# EasyEDA Pro project M0电赛.eprj

# Schematic Schematic3
Board Name: Board3; Create Date: 2025-07-26; Page Name: P1; Project Name: M0扩展版; Schematic Name: Schematic3; Update Date: 2025-07-27; Company: 嘉立创EDA; Page Size: A4; Version: V1.0
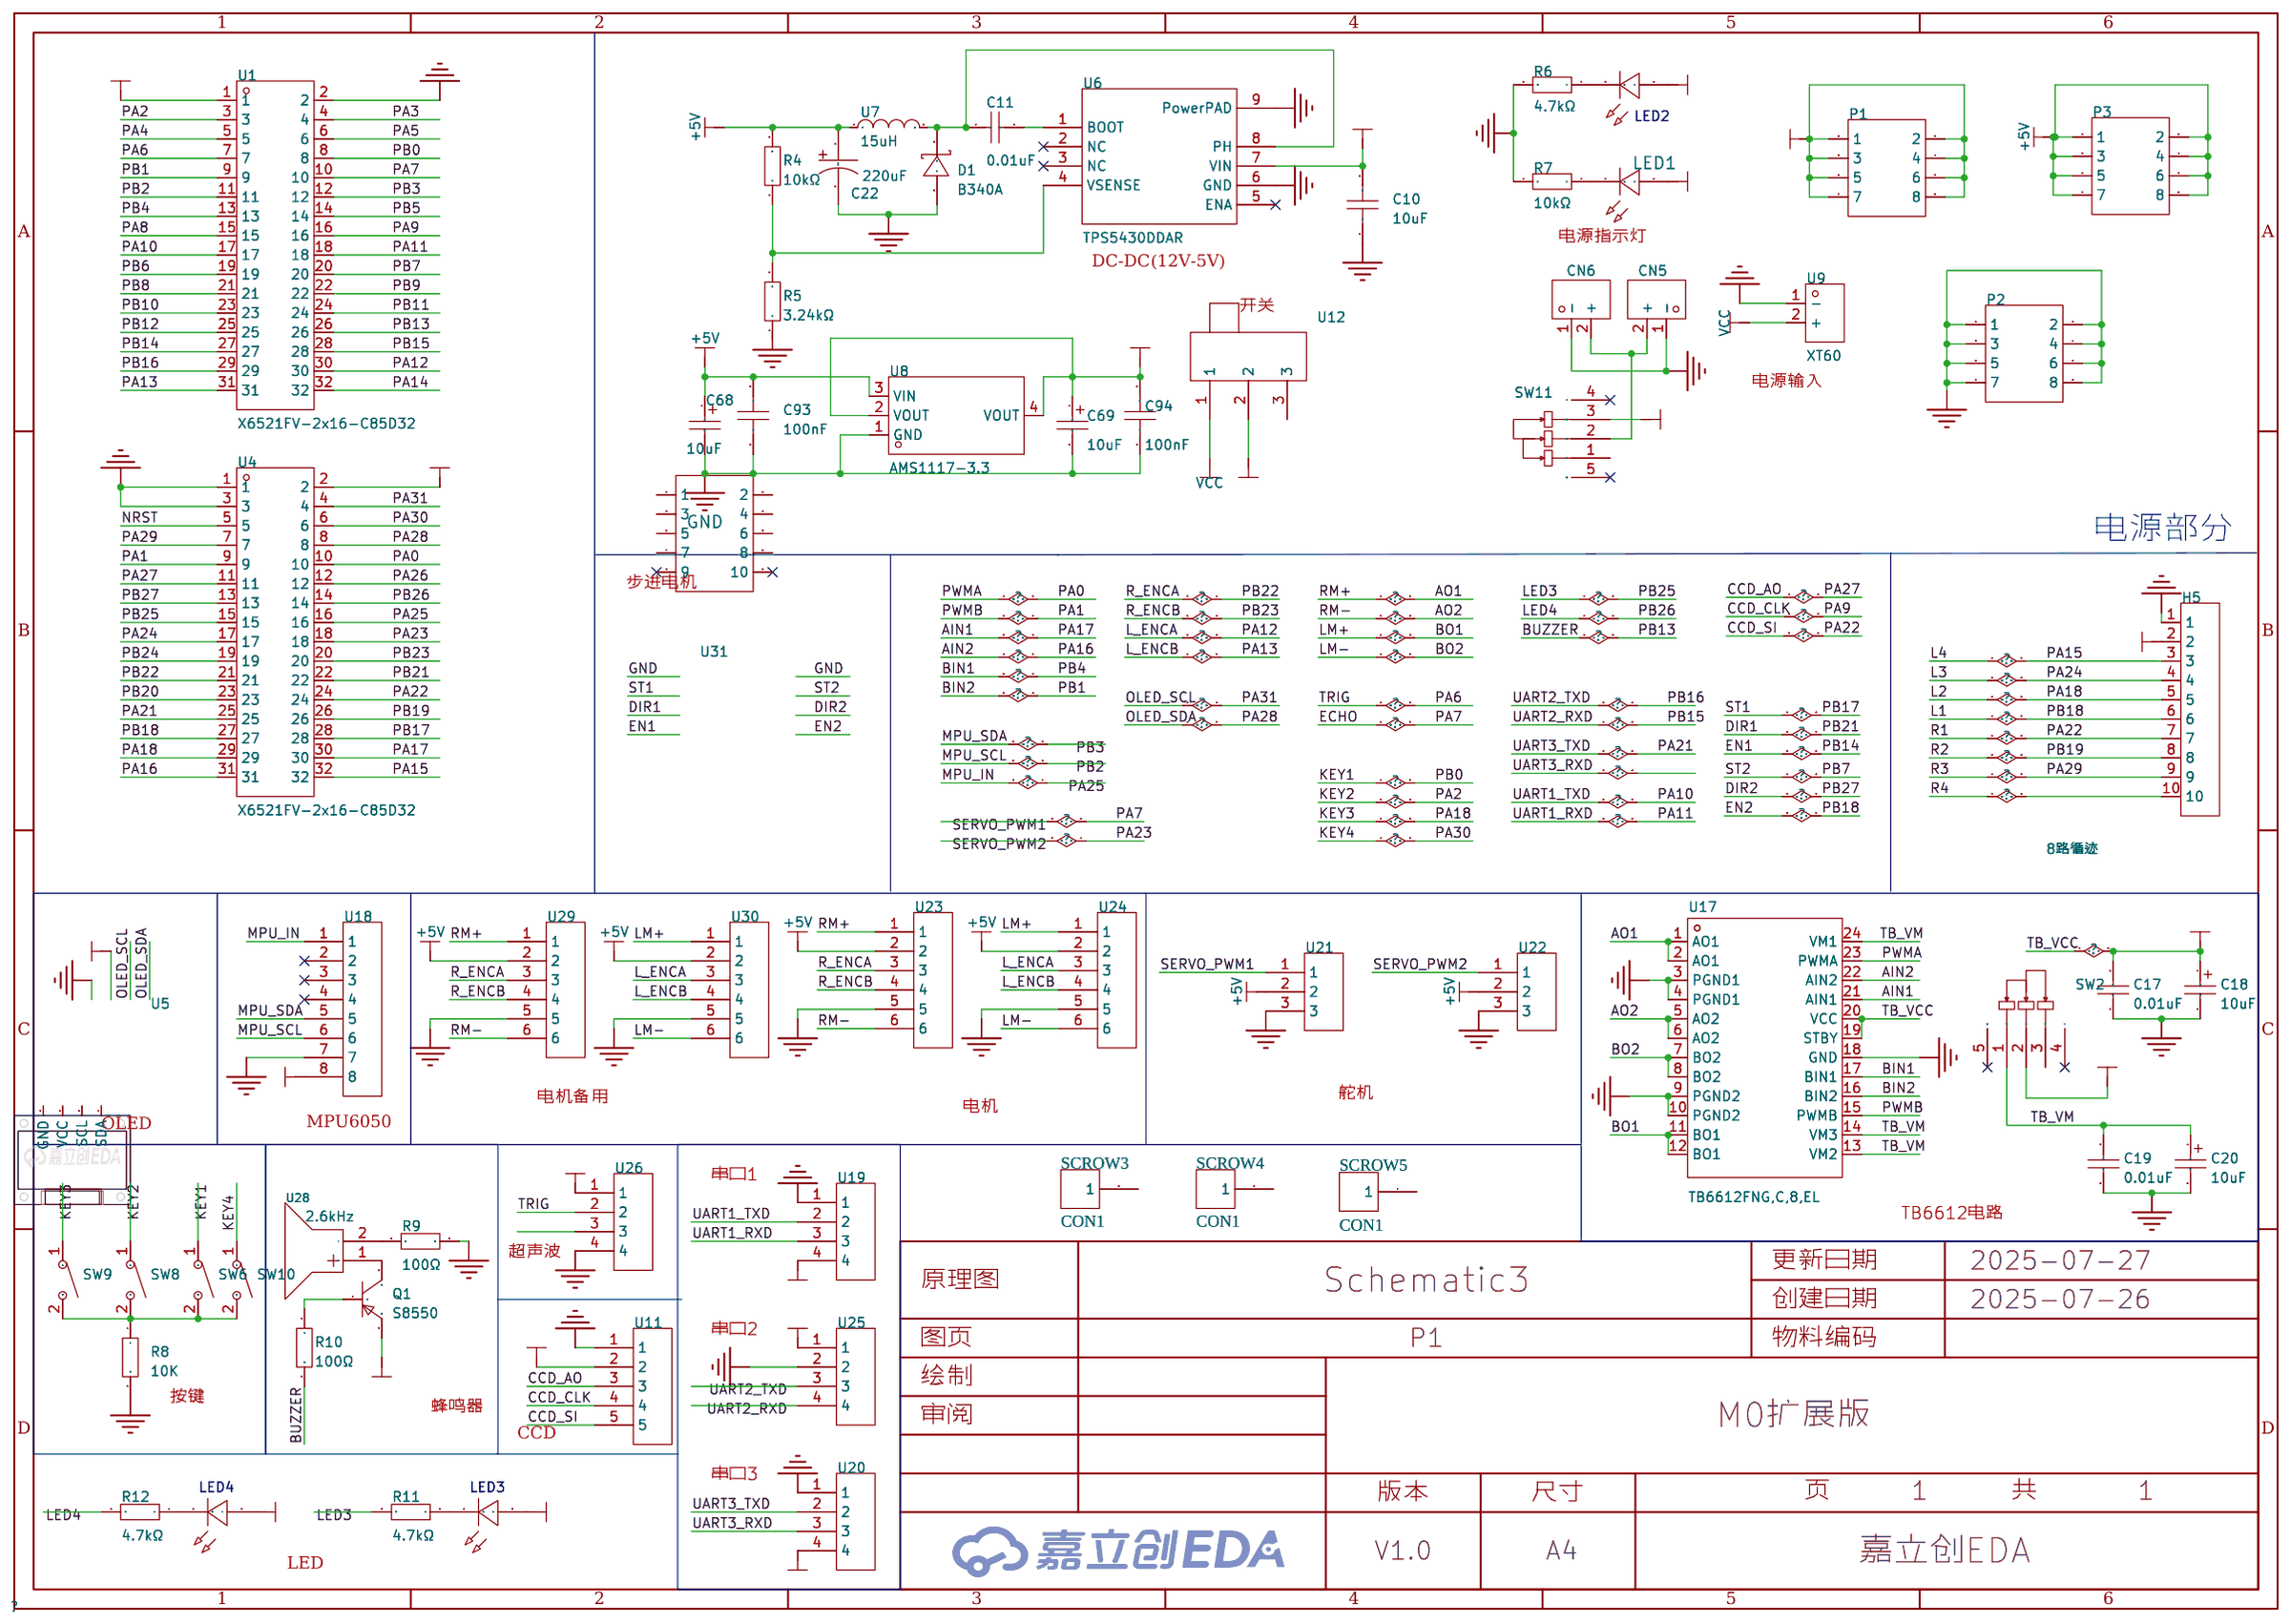
[diagram p0: schematic sheet]

## Parts
C10  10uF  [C0603]
C11  0.01uF  [C0603]
C17  0.01uF  [C0603]
C18  10uF  [case-b_3528]
C19  0.01uF  [C0603]
C20  10uF  [case-b_3528]
C22  220uF  [CAP-SMD_BD6.3-L6.6-W6.6-LS7.2-R-RD]
C68  10uF  [CAP-SMD_L3.2-W1.6-RD]
C69  10uF  [CAP-SMD_L3.2-W1.6-RD]
C93  100nF  [C0603]
C94  100nF  [C0603]
CN5  XT30UPB-M  [CONN-TH_XT30UPB-M]
CN6  XT30UPB-M  [CONN-TH_XT30UPB-M]
D1  B340A  [SMA_L4.3-W2.6-LS5.1-RD]
H5  8路循迹  [HDR-TH_10P-P2.54-V-M]
LED1  -  [led_0603]
LED2  -  [led_0603]
LED3  -  [led0603_blue]
LED4  -  [led0603_blue]
P1  直排针2X4P 2.54mm  [HDR-TH_8P-P2.54-V-M-R2-C4-S2.54]
P2  直排针2X4P 2.54mm  [HDR-TH_8P-P2.54-V-M-R2-C4-S2.54]
P3  直排针2X4P 2.54mm  [HDR-TH_8P-P2.54-V-M-R2-C4-S2.54]
Q1  S8550  [SOT-23-3_L2.9-W1.6-P1.90-LS2.8-BR]
R4  10kΩ  [R0603]
R5  3.24kΩ  [R0603]
R6  4.7kΩ  [R0603]
R7  10kΩ  [R0603]
R8  10K  [R0603]
R9  100Ω  [R0603]
R10  100Ω  [R0603]
R11  4.7kΩ  [R0603]
R12  4.7kΩ  [R0603]
SCROW3  CON1  [LQ_SCROW3&5MM]
SCROW4  CON1  [LQ_SCROW3&5MM]
SCROW5  CON1  [LQ_SCROW3&5MM]
SW2  SK12D07VG3  [SW-TH_SK12D07VG3]
SW6  轻触按键3*6*2.5  [SW-SMD_L6.0-W3.6-LS8.0]
SW8  轻触按键3*6*2.5  [SW-SMD_L6.0-W3.6-LS8.0]
SW9  轻触按键3*6*2.5  [SW-SMD_L6.0-W3.6-LS8.0]
SW10  轻触按键3*6*2.5  [SW-SMD_L6.0-W3.6-LS8.0]
SW11  SK12D07VG3  [SW-TH_SK12D07VG3]
U1  X6521FV-2x16-C85D32  [HDR-TH_32P-P2.54-V-F-R2-C16-S2.54]
U4  X6521FV-2x16-C85D32  [HDR-TH_32P-P2.54-V-F-R2-C16-S2.54]
U5  -  [0.96OLED_4P]
U6  TPS5430DDAR  [ESOP-8_L4.9-W3.9-P1.27-LS6.0-TL-EP]
U7  15uH  [IND-SMD_L6.6-W6.6]
U8  AMS1117-3.3  [SOT-223-3_L6.5-W3.4-P2.30-LS7.0-BR]
U9  XT60  [CONN-TH_XT60]
U11  -  [X2.54_5p]
U12  -  [拨动开关]
U17  TB6612FNG,C,8,EL  [SSOP-24_L8.3-W5.6-P0.65-LS7.6-BL]
U18  -  [MPU6050-8p]
U19  -  [XH2.54_4p]
U20  -  [XH2.54_4p]
U21  -  [X2.54_3p]
U22  -  [X2.54_3p]
U23  -  [XH2.54_6p]
U24  -  [XH2.54_6p]
U25  -  [XH2.54_4p]
U26  -  [XH2.54_4p]
U28  2.6kHz  [BUZ-TH_BD12.0-P7.60-D0.6-FD]
U29  -  [ph2.0]
U30  -  [ph2.0]
U31  -  [2*5p]

## Library data of the parts
C10 = CL10A106KP8NNNC: 容值:10uF;精度:±10%;额定电压:10V;材质(温度系数):X5R;; LCSC Part Name: 10uF ±10% 10V; Supplier Part: C19702; Manufacturer: SAMSUNG(三星); Supplier Footprint: 0603; JLCPCB Part Class: 基础库; Datasheet: https://atta.szlcsc.com/upload/public/pdf/source/20160218/1457707763339.pdf; Supplier: LCSC; Tolerance: ±10%; Voltage Rated: 10V; Temperature Coefficient: X5R
C11 C17 C19 = CL10C100JB8NNNC: 容值:10pF;精度:±5%;额定电压:50V;材质(温度系数):C0G;; LCSC Part Name: 10pF ±5% 50V; Supplier Part: C1634; Manufacturer: SAMSUNG(三星); Supplier Footprint: 0603; JLCPCB Part Class: 基础库; Datasheet: https://atta.szlcsc.com/upload/public/pdf/source/20160218/1457707763339.pdf; Supplier: LCSC; Tolerance: ±5%; Voltage Rated: 50V; Temperature Coefficient: C0G
C18 C20 = TAJC227K010RNJ: 容值:220uF;精度:±10%;额定电压:10V;等效串联电阻:500mΩ@100kHz;; LCSC Part Name: 220uF ±10% 10V; Supplier Part: C8023; Manufacturer: Kyocera AVX; Supplier Footprint: CASE-C-6032; JLCPCB Part Class: 扩展库; Datasheet: https://atta.szlcsc.com/upload/public/pdf/source/20160107/1457707750344.pdf; Supplier: LCSC; Tolerance: ±10%; Rated Voltage: 10V; Equivalent Series Resistance(ESR): 500mΩ@100kHz; Operating Temperature: -55℃~+125℃
C22 = VZT221M1CTR-0606ACS: 容值:220uF;精度:±20%;额定电压:16V;电容体直径:6.3mm;电容体长度:5.8mm;纹波电流:-;等效串联电阻:-;工作寿命:2000hrs@105℃;工作温度:-45℃~+105℃;; LCSC Part Name: 220uF ±20% 16V; Supplier Part: C286136; Manufacturer: lelon(立隆); Supplier Footprint: SMD,D6.3xL5.8mm; JLCPCB Part Class: Extended Part; Datasheet: https://atta.szlcsc.com/upload/public/pdf/source/20180921/C286136_B135157883311A80483BB6A4D6974578.pdf; Supplier: LCSC; Tolerance: ±20%; Rated Voltage: 16V; φD: 6.3mm; L: 5.8mm; Lifetime @ Temp: 2000hrs@105℃; Operating Temperature: -45℃~+105℃
C68 C69 = TC212A106K016Y: 容值:10uF;精度:±10%;额定电压:16V;等效串联电阻:3Ω@100kHz;; LCSC Part Name: 10uF ±10% 16V; Supplier Part: C108529; Manufacturer: Sunlord(顺络); Supplier Footprint: CASE-A-3216; JLCPCB Part Class: Extended Part; Datasheet: https://atta.szlcsc.com/upload/public/pdf/source/20210916/D7C773B25EB30D21AD10ECA5EBDA1DBD.pdf; Supplier: LCSC; Tolerance: ±10%; Rated Voltage: 16V; Equivalent Series Resistance(ESR): 3Ω@100kHz; Operating Temperature: -55℃~+125℃
C93 C94 = CC0603KRX7R9BB104: 容值:100nF;精度:±10%;额定电压:50V;材质(温度系数):X7R;; LCSC Part Name: 100nF ±10% 50V; Supplier Part: C14663; Manufacturer: YAGEO(国巨); Supplier Footprint: 0603; JLCPCB Part Class: 基础库; Datasheet: https://atta.szlcsc.com/upload/public/pdf/source/20180910/C282072_33301C7F631E79921B82A8DAC6BCC5B3.pdf; Supplier: LCSC; Tolerance: ±10%; Voltage Rated: 50V; Temperature Coefficient: X7R
CN5 CN6 = XT30UPB-M: Supplier Part: C428721; Manufacturer: AMASS(艾迈斯); JLCPCB Part Class: Extended Part; Datasheet: https://atta.szlcsc.com/upload/public/pdf/source/20190916/C428721_B0ECB8C5937139CEFE8736D2D3175B0E.pdf; Supplier: LCSC
D1 = B340A: 正向压降(Vf):550mV@3A;直流反向耐压(Vr):40V;平均整流电流(Io):3A;; LCSC Part Name: 电压:40V 电流:3A; Supplier Part: C64982; Manufacturer: MDD; Supplier Footprint: SMA(DO-214AC); JLCPCB Part Class: 扩展库; Datasheet: https://atta.szlcsc.com/upload/public/pdf/source/20230710/CC7CF81239BC87A7012E02A96905E83C.pdf; Supplier: LCSC; Forward Voltage (Vf@If): 550mV@3A; Reverse Voltage (Vr): 40V; Average Rectified Current (Io): 3A
H5 = PZ254V-11-10P: 插针结构:1x10P;间距:2.54mm;行距:-;圆针/方针:方针;安装方式:直插;排数:单排;总PIN位数:10P;额定电流:-;额定电压:-;配合针长度:6mm;塑高:2.5mm;端接针长度:3mm;触头材质:黄铜;触头镀层:-;工作温度:-40℃~+105℃;颜色:黑色;; LCSC Part Name: 1x10P 间距:2.54mm 方针 直插; Supplier Part: C492409; Manufacturer: XFCN(兴飞); Supplier Footprint: 插件,P=2.54mm; JLCPCB Part Class: 扩展库; Datasheet: https://atta.szlcsc.com/upload/public/pdf/source/20200309/C492409_129C9431BDD62EBBBD0A643B6AAB9FBD.pdf; Supplier: LCSC; Pin Structure: 1x10P; Pitch: 2.54mm; Circluar Pins/Square Pins: 方针; Mounting Type: 直插; Number of Rows: 单排; Number of Pins: 10P; Length of Mating Pin: 6mm; Insulation Height: 2.5mm; Length of End Connection Pin: 3mm; Contact Material: 黄铜; Operating Temperature: -40℃~+105℃; Color: 黑色
LED1 = LED_0402-R: Supplier Footprint: 0402
LED2-LED4 = LED_0402-G: Supplier Footprint: 0402
P1-P3 = 直排针2X4P 2.54mm: 排数:-;圆针/方针:-;额定电流:-;额定电压:-;配合针长度:-;塑高:-;触头材质:-;; LCSC Part Name: 排针 2*4P 2.54mm; Supplier Part: C58363; Manufacturer: BOOMELE(博穆精密); Supplier Footprint: 插件,P=2.54mm; JLCPCB Part Class: Extended Part; Datasheet: https://atta.szlcsc.com/upload/public/pdf/source/20151026/1457707506726.pdf; Supplier: LCSC
Q1 = S8550_C105432: 晶体管类型:PNP;集电极电流(Ic):500mA;集射极击穿电压(Vceo):25V;功率(Pd):300mW;直流电流增益(hFE@Ic,Vce):120@50mA,1V;; LCSC Part Name: S8550(RANGE:120-200) L档120-200; Supplier Part: C105432; Manufacturer: CJ(江苏长电/长晶); Supplier Footprint: SOT-23; JLCPCB Part Class: 基础库; Datasheet: https://atta.szlcsc.com/upload/public/pdf/source/20171228/C164891_15144412930301213894.pdf; Supplier: LCSC; Transistor Type: PNP; Collector Current (Ic): 500mA; Collector-Emitter Breakdown Voltage (Vceo): 25V; Power Dissipation (Pd): 300mW; DC Current Gain (hFE@Ic,Vce): 120@50mA,1V; Transition Frequency (fT): 150MHz; Collector Cut-Off Current (Icbo): 100nA; Collector-Emitter Saturation Voltage (VCE(sat)@Ic,Ib): 600mV@500mA,50mA
R4 R5 = 0603WAF1002T5E: 电阻类型:厚膜电阻;阻值:10kΩ;精度:±1%;功率:100mW;最大工作电压:75V;温度系数:±100ppm/℃;; LCSC Part Name: 厚膜电阻 10kΩ ±1% 100mW; Supplier Part: C25804; Manufacturer: UNI-ROYAL(厚声); Supplier Footprint: 0603; JLCPCB Part Class: 基础库; Datasheet: https://atta.szlcsc.com/upload/public/pdf/source/20200306/C422600_1E6D84923E4A46A82E41ADD87F860B5C.pdf; Supplier: LCSC; Type: 厚膜电阻; Tolerance: ±1%; Power(Watts): 100mW; Overload Voltage (Max): 75V; Temperature Coefficient: ±100ppm/℃; Operating Temperature Range: -55℃~+155℃
R6 R7 R11 R12 = 0603WAF4701T5E: 电阻类型:厚膜电阻;阻值:4.7kΩ;精度:±1%;功率:100mW;最大工作电压:75V;温度系数:±100ppm/℃;; LCSC Part Name: 4.7kΩ ±1% 100mW 厚膜电阻; Supplier Part: C23162; Manufacturer: UNI-ROYAL(厚声); Supplier Footprint: 0603; JLCPCB Part Class: 基础库; Datasheet: https://atta.szlcsc.com/upload/public/pdf/source/20200306/C422600_1E6D84923E4A46A82E41ADD87F860B5C.pdf; Supplier: LCSC; Type: 厚膜电阻; Tolerance: ±1%; Power(Watts): 100mW; Overload Voltage (Max): 75V; Temperature Coefficient: ±100ppm/℃; Operating Temperature Range: -55℃~+155℃
R8-R10 = Res_0603: Supplier Footprint: 0603
SCROW3-SCROW5 = CON1: Connector; Library Name: LQ8701
SW2 SW11 = SK12D07VG3: LCSC Part Name: 两档位卧式拨动开关,柄长3MM; Supplier Part: C431547; Manufacturer: SHOU HAN(首韩); Supplier Footprint: 插件; JLCPCB Part Class: Extended Part; Datasheet: https://atta.szlcsc.com/upload/public/pdf/source/20190925/C431547_01B93C6F3FA5C09E15F8CCBF4E6DB91A.pdf; Supplier: LCSC
SW6 SW8-SW10 = 轻触按键3*6*2.5: Supplier Part: C9900013040; Supplier Footprint: KEY; JLCPCB Part Class: 扩展库; Supplier: LCSC
U1 U4 = X6521FV-2x16-C85D32: 插孔结构:2x16P;间距:2.54mm;行距:2.54mm;圆孔/方孔:方孔;安装类型:直插;排数:双排;总孔位数:32P;额定电流:3A;额定电压:250V;插孔方向:顶部;塑高:8.5mm;触头材质:黄铜;触头镀层:金;工作温度范围:-40℃~+105℃;焊接温度(最大值):260℃;; LCSC Part Name: 间距:2.54mm 2x16P 直插; Supplier Part: C2883989; Manufacturer: XKB Connection(中国星坤); Supplier Footprint: 插件,P=2.54mm; JLCPCB Part Class: 扩展库; Datasheet: https://atta.szlcsc.com/upload/public/pdf/source/20211009/C636DBF0733662F7F428F4420CCBBD46.pdf; Supplier: LCSC; Holes Structure: 2x16P; Pitch: 2.54mm; Row Spacing: 2.54mm; Circular Hole / Square Hole: 方孔; Mounting Type: 直插; Number of Rows: 双排; Number of Holes: 32P; Current Rating (Max): 3A; Voltage Rating (Max): 250V; Holes Direction: 顶部; Insulation Height: 8.5mm; Contact Material: 黄铜; Contact Plating: 金; Operating Temperature Range: -40℃~+105℃; Soldering Temperature(Max): 260℃
U5 = 0.96OLED模块_4P: Supplier Footprint: 插件
U6 = TPS5430DDAR: 功能类型:降压型;输出类型:可调;输入电压:5.5V~36V;输出电压:1.221V~32.04V;输出电流(最大值):3A;; LCSC Part Name: 降压 3A 36V; Supplier Part: C9864; Manufacturer: TI(德州仪器); Supplier Footprint: SOIC-8-EP; JLCPCB Part Class: 基础库; Datasheet: https://www.ti.com/cn/lit/gpn/tps5430; Supplier: LCSC; Function: 降压型; Output Type: 可调; Input Voltage: 5.5V~36V; Output Voltage: 1.221V~32.04V; Output Current (Max): 3A; Switching Frequency: 500kHz; Operating Temperature: -40℃~+125℃@(TJ); Synchronous Rectification: 否; Number of Outputs: 1; Topology: 降压式; Switch tube (built-in/external): 内置
U7 = 15uH: Supplier Part: C9900014578; Supplier Footprint: L_电感_7*7; JLCPCB Part Class: 扩展库; Supplier: LCSC
U8 = AMS1117-3.3_C6186: 输出类型:固定;最大输入电压:-;输出电压:3.3V;最大输出电流:1A;电源纹波抑制比(PSRR):72dB@(120Hz);输出极性:正极;; LCSC Part Name: 输出3.3V 1A; Supplier Part: C6186; Manufacturer: AMS; Supplier Footprint: SOT-223; JLCPCB Part Class: 基础库; Datasheet: https://atta.szlcsc.com/upload/public/pdf/source/20180727/C6186_7A095716F0823C02F1997A905E26C086.pdf; Supplier: LCSC; Output Type: 固定; Output Voltage: 3.3V; MAX Output Current: 1A; Power Supply Rejection Ratio (PSRR): 72dB@(120Hz); Dropout Voltage: 1.3V@(800mA); Output Polarity: 正极; Number of Outputs: 1
U9 = XT60: 类别:-;类型1:-;; LCSC Part Name: AMASS(艾迈斯) XT60模型插头 3.5mm镀金香蕉头公头（电调端）XT60-M; Supplier Part: C98733; Manufacturer: AMASS(艾迈斯); JLCPCB Part Class: 扩展库; Datasheet: https://atta.szlcsc.com/upload/public/pdf/source/20170606/1496716524919.pdf; Supplier: LCSC; Brand: 艾迈斯; Type: 香蕉头; Colour: 黄色; InterfaceType: 公头; specifications: 3.5mm
U11 = X2.54_5p
U12 = 拨动开关
U17 = TB6612FNG,C,8,EL: 驱动电机类型:有刷直流电机;电源电压:2.7V~5.5V;输出电流:1A;接口:并行;; LCSC Part Name: 1A 有刷直流电机驱动芯片 5.5V; Supplier Part: C141517; Manufacturer: TOSHIBA(东芝); Supplier Footprint: SSOP-24; JLCPCB Part Class: 扩展库; Datasheet: https://atta.szlcsc.com/upload/public/pdf/source/20171128/C141517_15118625624231147036.pdf; Supplier: LCSC; Drive motor type: 有刷直流电机; Supply Voltage: 2.7V~5.5V; Output Current: 1A; Interface: 并行; Operating Temperature: -20℃~+85℃@(Ta)
U18 = MPU6050_8p
U19 U20 U25 U26 = XH2.54_4P
U21 U22 = X2.54 _3p
U23 U24 U29 U30 = XH2.54_6p
U28 = HYE1206-05ST: 频率:2.6kHz;声压(SPL):80dB@5V,10cm;; LCSC Part Name: 有源蜂鸣器HYE1206-05ST; Supplier Part: C17701079; Manufacturer: HYDZ(华宇); Supplier Footprint: 插件,D=7.6mm; Datasheet: https://atta.szlcsc.com/upload/public/pdf/source/20230912/EF3443D3A1B92F495A3EE65EE7F2091F.pdf; Supplier: LCSC; Sound Pressure Level (SPL): 80dB@5V,10cm
U31 = 2*5p

## Nets
3V3: C17.2 C18.1 C69.1 C94.2 LED2.2(A) LED3.2(A) LED4.2(A) P1.1 P1.2 P1.3 P1.4 P1.5 P1.6 P1.7 P1.8 Q1.2 U1.1 U4.2 U8.2(VOUT) U8.4(VOUT) U11.2 U17.19(STBY) U17.20(VCC) U18.8 U19.4 U20.4 U25.1 U26.1
5V: H5.2
+5V: C22.1 C68.1 C93.2 LED1.2(A) P3.1 P3.2 P3.3 P3.4 P3.5 P3.6 P3.7 P3.8 R4.2 U7.1 U8.3(VIN) U21.2 U22.2 U23.2 U24.2 U29.2 U30.2
+12V: C10.2 SW2.2 SW11.3 U6.7(VIN) U12.2
GND: C10.1 C17.1 C18.2 C19.1 C20.2 C22.2 C68.2 C69.2 C93.1 C94.1 CN5.1(-) CN6.1(-) D1.2(A) H5.1 P2.1 P2.2 P2.3 P2.4 P2.5 P2.6 P2.7 P2.8 R5.1 R6.2 R7.2 R8.2 R9.1 U1.2 U4.1 U4.3 U6.6(GND) U6.9(PowerPAD) U8.1(GND) U9.1(-) U11.1 U17.3(PGND1) U17.4(PGND1) U17.9(PGND2) U17.10(PGND2) U17.18(GND) U18.7 U19.1 U20.1 U21.3 U22.3 U23.5 U24.5 U25.2 U26.4 U29.5 U30.5
VCC: U9.2(+) U12.1
AIN1: U4.30 U17.21(AIN1)
AIN2: U4.31 U17.22(AIN2)
AO1: U17.1(AO1) U17.2(AO1) U23.1 U29.1
AO2: U17.5(AO2) U17.6(AO2) U23.6 U29.6
BIN1: U1.13 U17.17(BIN1)
BIN2: U1.9 U17.16(BIN2)
BO1: U17.11(BO1) U17.12(BO1) U24.1 U30.1
BO2: U17.7(BO2) U17.8(BO2) U24.6 U30.6
BUZZER: R10.2 U1.26
CCD_AO: U4.11 U11.3
CCD_CLK: U1.16 U11.4
CCD_SI: H5.7 U4.24 U11.5
DIR1: U4.22
DIR2: U4.13
ECHO: U1.10 U21.1
EN1: U1.27
EN2: H5.6 U4.27
KEY1: SW6.1 U1.8
KEY2: SW8.1 U1.3
KEY3: H5.5 SW9.1 U4.29
KEY4: SW10.1 U4.6
L3: H5.4 U4.17
L4: H5.3 U4.32
L_ENCA: U1.30 U24.3 U30.3
L_ENCB: U1.31 U24.4 U30.4
LED3: R11.2 U4.15
LED4: R12.2 U4.14
MPU_IN: U4.16 U18.1
MPU_SCL: U1.11 U18.6
MPU_SDA: U1.12 U18.5
NRST: U4.5
OLED_SCL: U4.4
OLED_SDA: U4.8
PA0: U4.10 U17.23(PWMA)
PA1: U4.9 U17.15(PWMB)
PA3: U1.4
PA4: U1.5
PA5: U1.6
PA6: U1.7 U26.2
PA8: U1.15
PA10: U1.17 U19.2
PA11: U1.18 U19.3
PA14: U1.32
PA21: U4.25 U20.2
PA23: U4.18 U22.1
PA26: U4.12
PA29: H5.9 U4.7
PB5: U1.14
PB6: U1.19
PB7: U1.20
PB8: U1.21
PB9: U1.22
PB10: U1.23
PB11: U1.24
PB12: U1.25
PB15: U1.28 U25.4
PB16: U1.29 U25.3
PB17: U4.28
PB19: H5.8 U4.26
PB20: U4.23
PB22: U4.21 U23.3 U29.3
PB23: U4.20 U23.4 U29.4
PB24: U4.19
R4: H5.10
TB_VM: C19.2 C20.1 SW2.1 U17.13(VM2) U17.14(VM3) U17.24(VM1)
UART3_RXD: U20.3
$1N1731: LED2.1(C) R6.1
$1N1733: LED1.1(C) R7.1
$1N2121: C11.2 U6.1(BOOT)
$1N2122: C11.1 D1.1(K) U6.8(PH) U7.2
$1N2124: R4.1 R5.2 U6.4(VSENSE)
$1N2587: R8.1 SW6.2 SW8.2 SW9.2 SW10.2
$1N2737: LED3.1(C) R11.1
$1N2739: LED4.1(C) R12.1
$1N3007: Q1.3 U28.1(+)
$1N3009: Q1.1 R10.1
$1N3011: R9.2 U28.2(-)
$1N21326: CN5.2(+) CN6.2(+) SW11.2

Not connected (* = marked no-connect by the designer): SCROW3 1; SCROW4 1; SCROW5 1; SW2 3 4* 5*; SW11 1 4* 5*; U5 1(GND) 2(VCC) 3(SCL) 4(SDA); U6 2(NC)* 3(NC)* 5(ENA)*; U12 3; U18 2* 3* 4*; U26 3; U31 1 2 3 4 5 6 7 8 9* 10*

## Notes on the sheet
- 电源指示灯
- DC-DC(12V-5V)
- 开关
- 电源输入
- 电源部分
- 步进电机
- 电机备用
- 电机
- 舵机
- OLED
- MPU6050
- 串口1
- TB6612电路
- 超声波
- 串口2
- 按键
- 蜂鸣器
- CCD
- 串口3
- LED

# Board PCB3
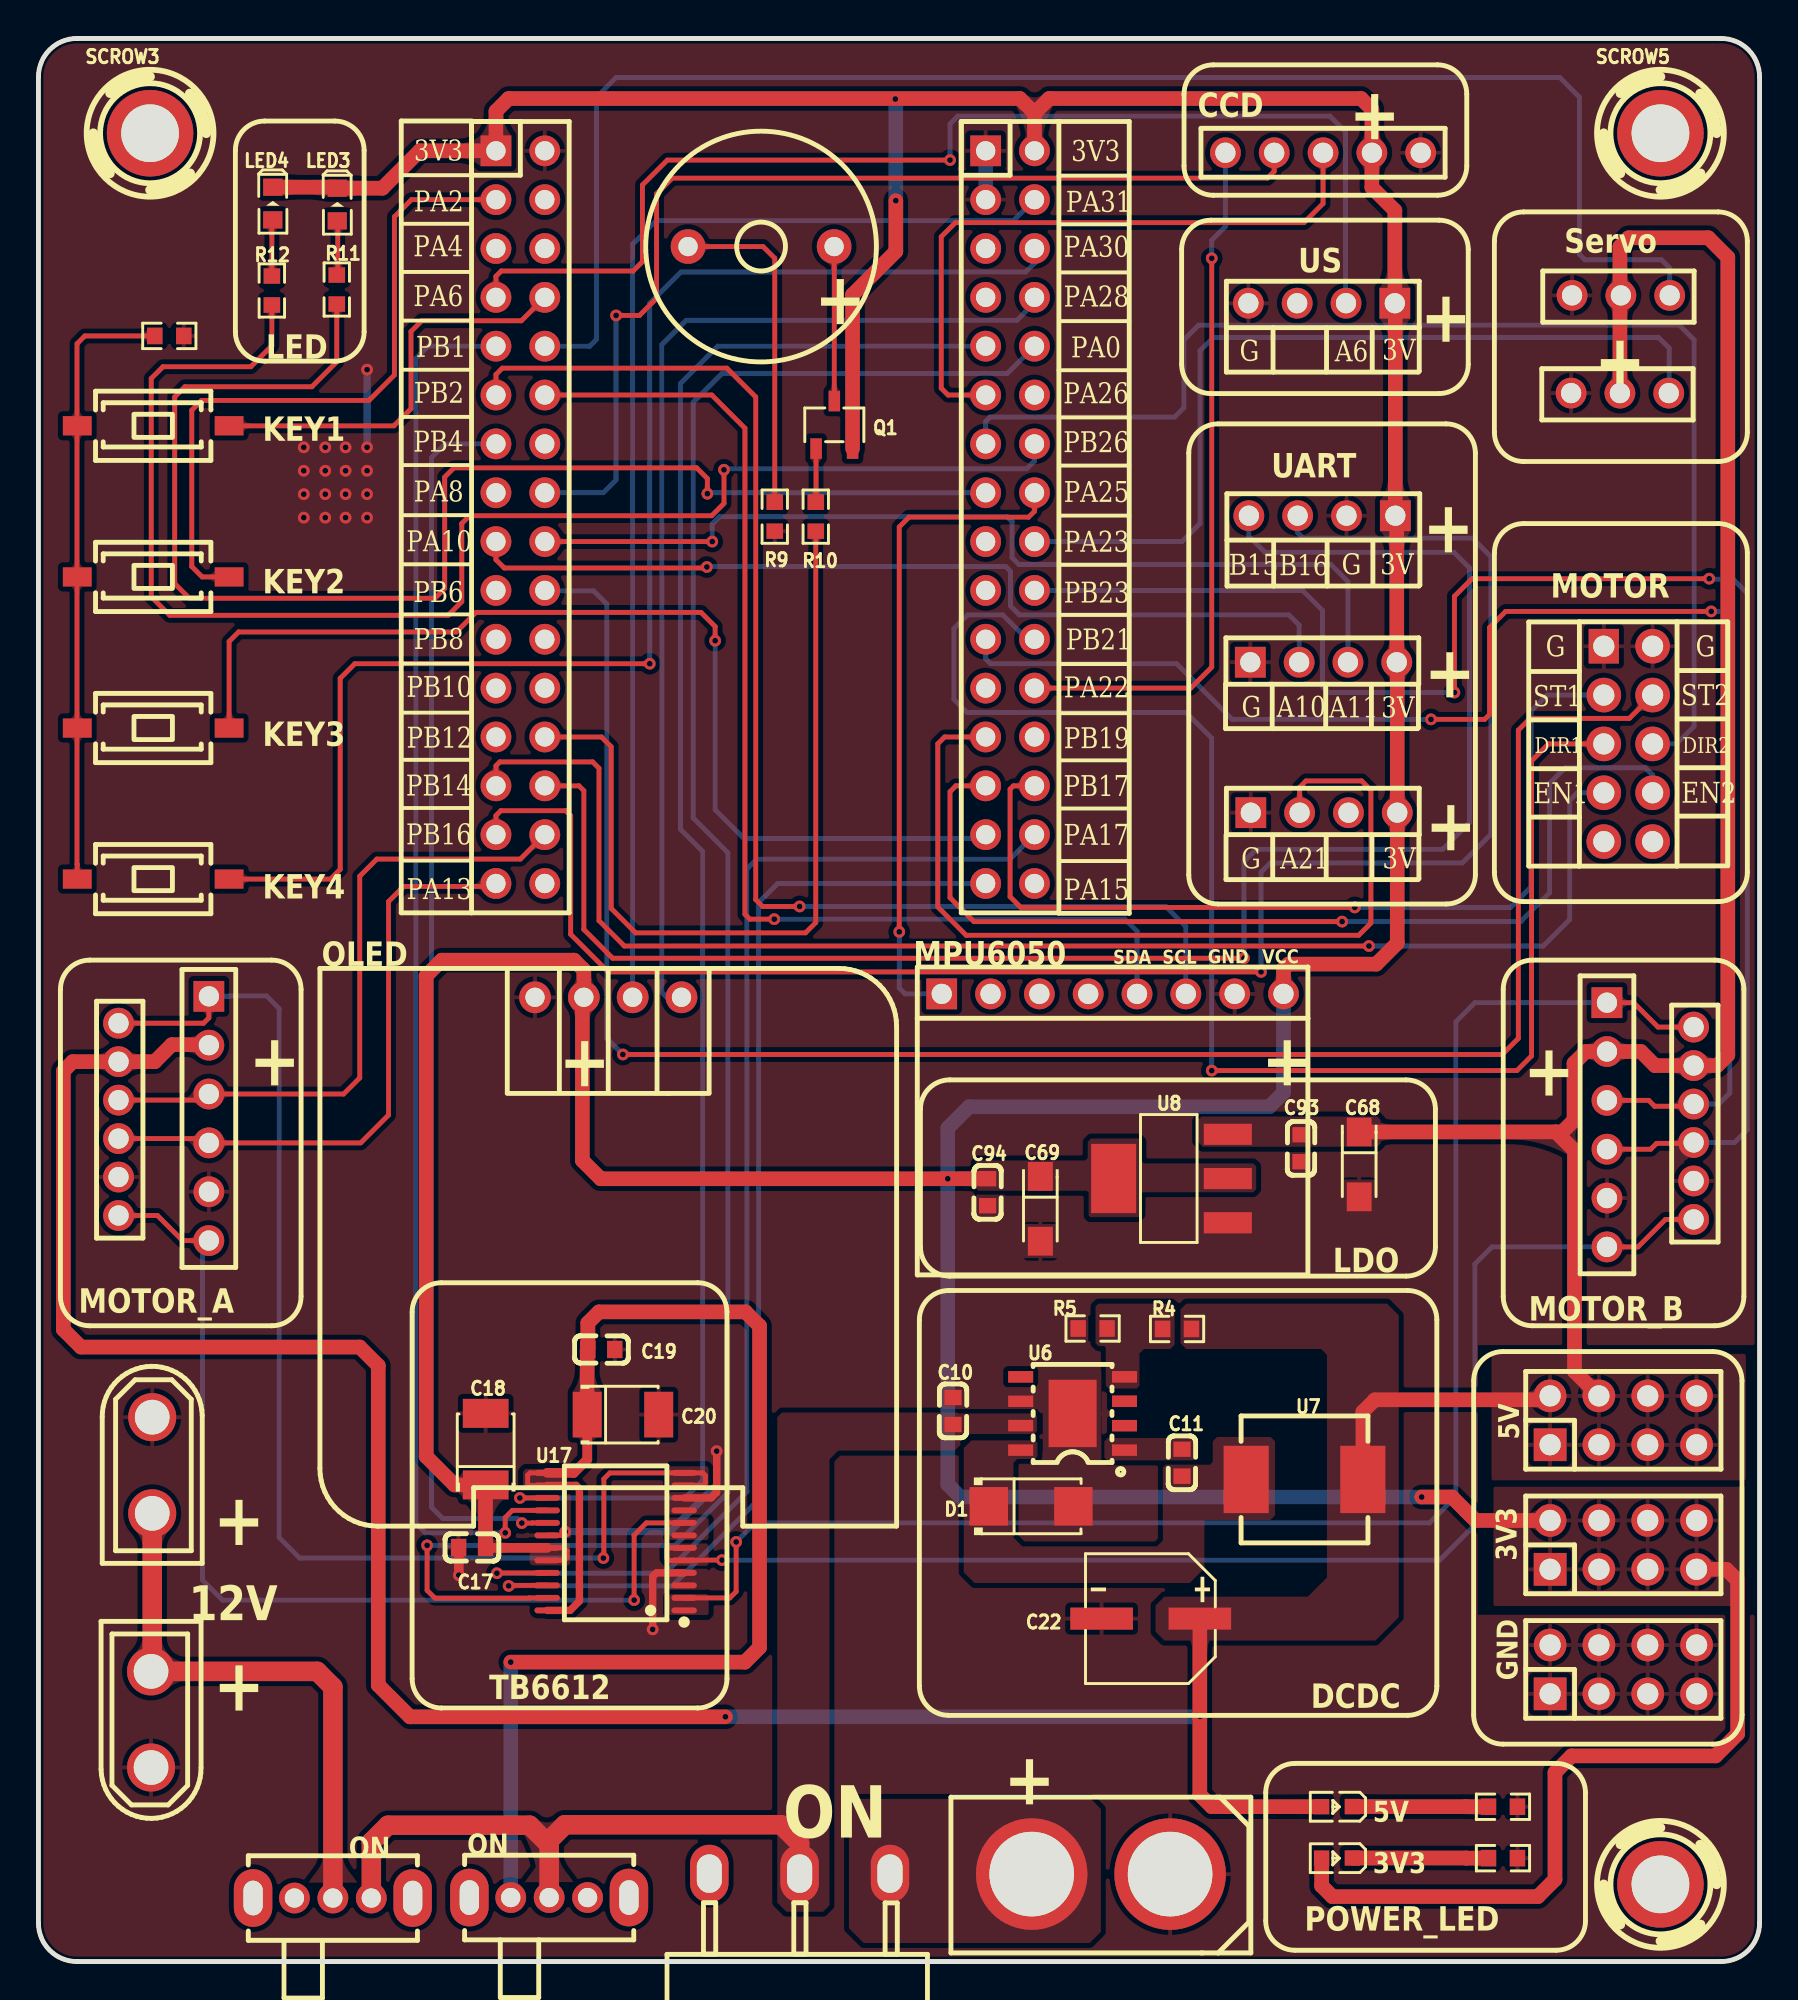
[diagram p1: board, top side]
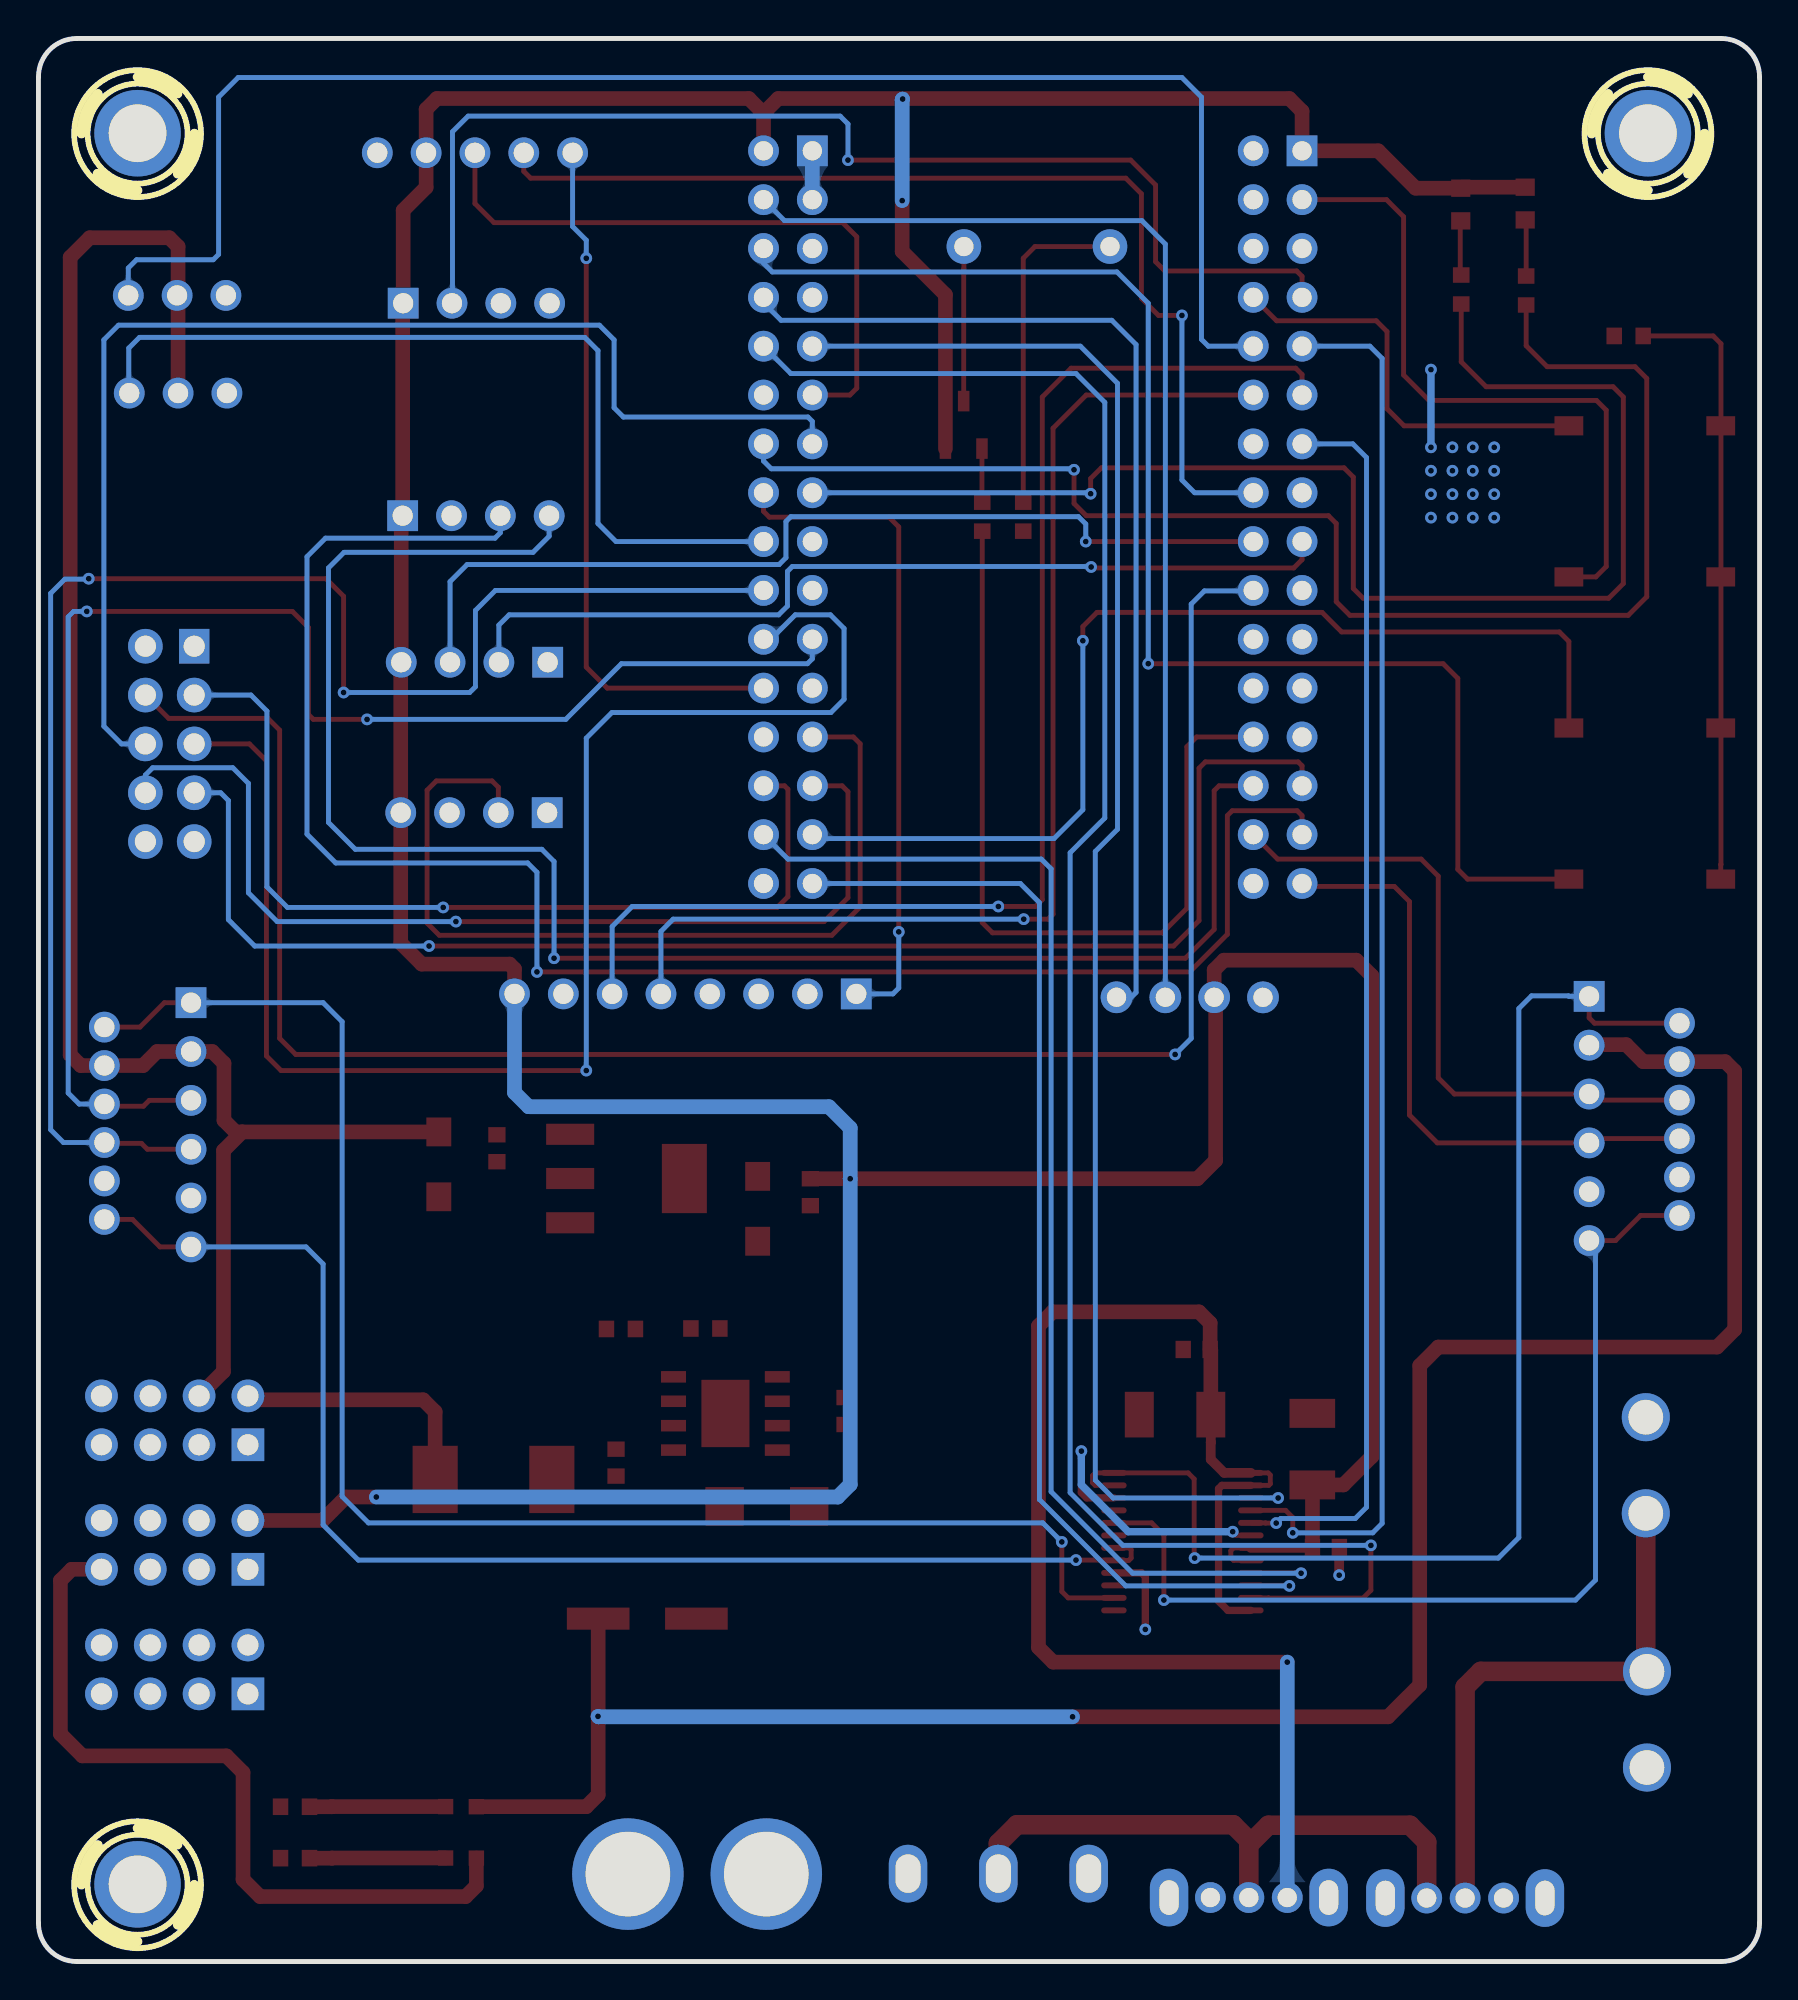
[diagram p2: board, bottom side, seen from below]

Outline 89.53 x 100 mm; copper layers: Top Layer, Bottom Layer. Coordinates in mm from the lower left corner of the outline.
Outline path: 0,98 0,2 arc(0.59,0.59) 2,0 87.53,0 arc(88.95,0.59) 89.53,2 89.53,98 arc(88.95,99.41) 87.53,100 2,100 arc(0.59,99.41) 0,98
Stack: Top Layer 0.035mm / Dielectric1 1.51mm FR4 er 4.5 / Bottom Layer 0.035mm

## Design rules (mm)
template: JLCPCB Capability(Two Layers Board)
spacing copperThickness1oz (default): track to track 0.102, other pairs 0.152 to 0.3
spacing copperThickness2oz: track to track 0.203, other pairs 0.152 to 0.3
track width copperThickness1oz (default): min 0.127, default 0.254, max 2.54
track width copperThickness2oz: min 0.203, default 0.254, max 2.54
differential pair differentialPair (default): width min 0.127, default 0.254, max 2.54; gap min 0.152, default 0.152
via viaSize (default): diameter min 0.5, default 0.61, max 10; hole min 0.3, default 0.305, max 6.3

## Placement (name value [footprint] x y rotation side)
C10  10uF  [C0603]  47.57 28.63 270 top
C11  0.01uF  [C0603]  59.49 25.94 90 top
C17  0.01uF  [C0603]  22.56 21.53 0 top
C18  10uF  [case-b_3528]  23.27 26.65 90 top
C19  0.01uF  [C0603]  29.28 31.83 180 top
C20  10uF  [case-b_3528]  30.41 28.44 0 top
C22  220uF  [CAP-SMD_BD6.3-L6.6-W6.6-LS7.2-R-RD]  57.86 17.83 0 top
C68  10uF  [CAP-SMD_L3.2-W1.6-RD]  68.71 41.45 270 top
C69  10uF  [CAP-SMD_L3.2-W1.6-RD]  52.12 39.14 270 top
C93  100nF  [C0603]  65.68 42.29 90 top
C94  100nF  [C0603]  49.38 40 90 top
CN5  XT30UPB-M  [CONN-TH_XT30UPB-M]  5.86 12.59 90 top
CN6  XT30UPB-M  [CONN-TH_XT30UPB-M]  5.92 25.81 270 top
D1  B340A  [SMA_L4.3-W2.6-LS5.1-RD]  51.64 23.67 0 top
LED1  -  [led_0603]  67.5 8.05 180 top
LED2  -  [led_0603]  67.5 5.37 180 top
LED3  -  [led0603_blue]  15.54 91.36 90 top
LED4  -  [led0603_blue]  12.19 91.42 90 top
P1  直排针2X4P 2.54mm  [HDR-TH_8P-P2.54-V-M-R2-C4-S2.54]  82.45 21.67 0 top
P2  直排针2X4P 2.54mm  [HDR-TH_8P-P2.54-V-M-R2-C4-S2.54]  82.45 15.19 0 top
P3  直排针2X4P 2.54mm  [HDR-TH_8P-P2.54-V-M-R2-C4-S2.54]  82.45 28.14 0 top
Q1  S8550  [SOT-23-3_L2.9-W1.6-P1.90-LS2.8-BR]  41.4 79.91 270 top
R4  10kΩ  [R0603]  59.23 32.89 0 top
R5  3.24kΩ  [R0603]  54.84 32.92 0 top
R6  4.7kΩ  [R0603]  76.19 5.38 0 top
R7  10kΩ  [R0603]  76.19 8.05 0 top
R8  10K  [R0603]  6.81 84.53 0 top
R9  100Ω  [R0603]  38.3 75.13 90 top
R10  100Ω  [R0603]  40.44 75.13 270 top
R11  4.7kΩ  [R0603]  15.52 86.94 270 top
R12  4.7kΩ  [R0603]  12.14 86.89 270 top
SCROW3  CON1  [LQ_SCROW3&5MM]  5.81 95.07 0 top
SCROW4  CON1  [LQ_SCROW3&5MM]  84.38 4.01 0 top
SCROW5  CON1  [LQ_SCROW3&5MM]  84.38 95.07 0 top
SW2  SK12D07VG3  [SW-TH_SK12D07VG3]  26.57 3.33 0 top
SW6  轻触按键3*6*2.5  [SW-SMD_L6.0-W3.6-LS8.0]  5.97 79.86 180 top
SW8  轻触按键3*6*2.5  [SW-SMD_L6.0-W3.6-LS8.0]  5.97 72 180 top
SW9  轻触按键3*6*2.5  [SW-SMD_L6.0-W3.6-LS8.0]  5.97 64.14 180 top
SW10  轻触按键3*6*2.5  [SW-SMD_L6.0-W3.6-LS8.0]  5.97 56.29 180 top
SW11  SK12D07VG3  [SW-TH_SK12D07VG3]  15.32 3.3 0 top
U1  X6521FV-2x16-C85D32  [HDR-TH_32P-P2.54-V-F-R2-C16-S2.54]  25.07 75.11 270 top
U4  X6521FV-2x16-C85D32  [HDR-TH_32P-P2.54-V-F-R2-C16-S2.54]  50.55 75.11 270 top
U5  -  [0.96OLED_4P]  29.64 50.14 0 top
U6  TPS5430DDAR  [ESOP-8_L4.9-W3.9-P1.27-LS6.0-TL-EP]  53.8 28.5 180 top
U7  15uH  [IND-SMD_L6.6-W6.6]  65.86 25.07 180 top
U8  AMS1117-3.3  [SOT-223-3_L6.5-W3.4-P2.30-LS7.0-BR]  58.9 40.72 0 top
U9  XT60  [CONN-TH_XT60]  55.27 4.55 180 top
U11  -  [X2.54_5p]  68.86 93.93 180 top
U12  -  [拨动开关]  44.3 4.57 180 top
U17  TB6612FNG,C,8,EL  [SSOP-24_L8.3-W5.6-P0.65-LS7.6-BL]  30.03 21.84 90 top
U18  -  [MPU6050-8p]  49.66 50.32 0 top
U19  -  [XH2.54_4p]  68.25 67.69 0 top
U20  -  [XH2.54_4p]  68.28 59.87 0 top
U21  -  [X2.54_3p]  83.59 86.64 180 top
U22  -  [X2.54_3p]  83.54 81.56 180 top
U23  -  [XH2.54_6p]  81.34 42.75 270 top
U24  -  [XH2.54_6p]  8.61 43.08 270 top
U25  -  [XH2.54_4p]  65.38 75.06 180 top
U26  -  [XH2.54_4p]  65.35 86.11 180 top
U28  2.6kHz  [BUZ-TH_BD12.0-P7.60-D0.6-FD]  37.59 89.18 180 top
U29  -  [ph2.0]  86.11 43.51 270 top
U30  -  [ph2.0]  4.17 43.71 270 top
U31  -  [2*5p]  83.46 67.51 0 top

## Footprints (pads in the part's own frame, mm; a bottom-side part is the same pattern mirrored in y, then rotated)
0.96OLED_4P
  round 1.65 hole 1: 1(-3.81,-0.002) 2(-1.27,0.002) 3(1.27,0.002) 4(3.81,0.002)
2*5p
  rect 1.575x1.8 hole 1.1: 1(-2.032,0.889)
  round 1.8 hole 1.1: 2(0.508,0.889) 3(-2.032,-1.651) 4(0.508,-1.651) 5(-2.032,-4.191) 6(0.508,-4.191) 7(-2.032,-6.731) 8(0.508,-6.731) 9(-2.032,-9.271) 10(0.508,-9.271)
BUZ-TH_BD12.0-P7.60-D0.6-FD
  round 1.8 hole 1: 1(-3.8,0) 2(3.8,0)
C0603
  rect 0.8x0.9 smd: 1(-0.7,0) 2(0.7,0)
CAP-SMD_BD6.3-L6.6-W6.6-LS7.2-R-RD
  rect 3.26x1.15 smd: 1(2.555,0) 2(-2.555,0)
CAP-SMD_L3.2-W1.6-RD
  rect 1.5x1.296 smd: 1(-1.687,0) 2(1.687,0)
case-b_3528
  rect 1.506x2.376 smd: 1(-1.861,0) 2(1.861,0)
CONN-TH_XT30UPB-M
  round 2.499 hole 1.801: 1(-2.499,0) 2(2.499,0)
CONN-TH_XT60
  round 5.8 hole 4.4: 1(-3.6,0) 2(3.6,0)
ESOP-8_L4.9-W3.9-P1.27-LS6.0-TL-EP
  rect 1.3x0.6 smd: 1(-2.7,1.905) 2(-2.7,0.635) 3(-2.7,-0.635) 4(-2.7,-1.905) 5(2.7,-1.905) 6(2.7,-0.635) 7(2.7,0.635) 8(2.7,1.905)
  rect 2.5x3.5 smd: 9(0,0)
HDR-TH_8P-P2.54-V-M-R2-C4-S2.54
  rect 1.7x1.7 hole 1.1: 1(-3.81,-1.27)
  round 1.7 hole 1.1: 2(-3.81,1.27) 3(-1.27,-1.27) 4(-1.27,1.27) 5(1.27,-1.27) 6(1.27,1.27) 7(3.81,-1.27) 8(3.81,1.27)
HDR-TH_32P-P2.54-V-F-R2-C16-S2.54
  rect 1.6x1.6 hole 1: 1(-19.05,-1.27)
  round 1.6 hole 1: 2(-19.05,1.27) 3(-16.51,-1.27) 4(-16.51,1.27) 5(-13.97,-1.27) 6(-13.97,1.27) 7(-11.43,-1.27) 8(-11.43,1.27) 9(-8.89,-1.27) 10(-8.89,1.27) 11(-6.35,-1.27) 12(-6.35,1.27) 13(-3.81,-1.27) 14(-3.81,1.27) 15(-1.27,-1.27) 16(-1.27,1.27) 17(1.27,-1.27) 18(1.27,1.27) 19(3.81,-1.27) 20(3.81,1.27) 21(6.35,-1.27) 22(6.35,1.27) 23(8.89,-1.27) 24(8.89,1.27) 25(11.43,-1.27) 26(11.43,1.27) 27(13.97,-1.27) 28(13.97,1.27) 29(16.51,-1.27) 30(16.51,1.27) 31(19.05,-1.27) 32(19.05,1.27)
IND-SMD_L6.6-W6.6
  rect 2.35x3.5 smd: 1(-3.035,0) 2(3.035,0)
led0603_blue
  rect 0.9x1 smd: 1(-0.85,0) 2(0.85,0)
led_0603
  rect 0.8x0.8 smd: 1(-0.851,-0.01) 2(0.75,-0.005)
LQ_SCROW3&5MM
  round 4.5 hole 3: 1(0,0)
MPU6050-8p
  rect 1.6x1.6 hole 1.05: 1(-2.667,0)
  round 1.6 hole 1.05: 2(-0.127,0) 3(2.413,0) 4(4.953,0) 5(7.493,0) 6(10.033,0) 7(12.573,0) 8(15.113,0)
ph2.0
  round 1.6 hole 1.05: 1(-5.08,0) 2(-3.08,0) 3(-1.08,0) 4(0.92,0) 5(2.92,0) 6(4.92,0)
R0603
  rect 0.806x0.864 smd: 1(-0.753,0) 2(0.753,0)
SMA_L4.3-W2.6-LS5.1-RD
  rect 2x2 smd: 1(-2.2,0) 2(2.2,0)
SOT-23-3_L2.9-W1.6-P1.90-LS2.8-BR
  rect 1.07x0.6 smd: 1(1.235,-0.95) 2(1.235,0.95) 3(-1.235,0)
SOT-223-3_L6.5-W3.4-P2.30-LS7.0-BR
  rect 2.5x1.1 smd: 1(2.97,-2.3) 2(2.97,0) 3(2.97,2.3)
  rect 2.34x3.6 smd: 4(-2.97,0)
SSOP-24_L8.3-W5.6-P0.65-LS7.6-BL
  oval 0.308x1.324 smd: 1(-3.575,-3.562) 2(-2.925,-3.562) 3(-2.275,-3.562) 4(-1.625,-3.562) 5(-0.975,-3.562) 6(-0.325,-3.562) 7(0.325,-3.562) 8(0.975,-3.562) 9(1.625,-3.562) 10(2.275,-3.562) 11(2.925,-3.562) 12(3.575,-3.562) 13(3.575,3.562) 14(2.925,3.562) 15(2.275,3.562) 16(1.625,3.562) 17(0.975,3.562) 18(0.325,3.562) 19(-0.325,3.562) 20(-0.975,3.562) 21(-1.625,3.562) 22(-2.275,3.562) 23(-2.925,3.562) 24(-3.575,3.562)
SW-SMD_L6.0-W3.6-LS8.0
  rect 1.5x1 smd: 1(-3.95,0) 2(3.95,0)
SW-TH_SK12D07VG3
  oval 1.6x1.6 hole 1.001: 1(-1.999,0) 2(0,0) 3(1.999,0)
  oval 1.999x2.999 hole 1.001x1.801: 4(4.151,0) 5(-4.151,0)
X2.54_3p
  round 1.6 hole 1.05: 1(-1.27,0) 2(1.27,0) 3(3.81,0)
X2.54_5p
  round 1.6 hole 1.05: 1(-3.048,-0.127) 2(-0.508,-0.127) 3(2.032,-0.127) 4(4.572,-0.127) 5(7.112,-0.127)
XH2.54_4p
  rect 1.6x1.6 hole 1.05: 1(-5.207,-0.127)
  round 1.6 hole 1.05: 2(-2.667,-0.127) 3(-0.127,-0.127) 4(2.413,-0.127)
XH2.54_6p
  rect 1.6x1.6 hole 1.05: 1(-7.112,0.254)
  round 1.6 hole 1.05: 2(-4.572,0.254) 3(-2.032,0.254) 4(0.508,0.254) 5(3.048,0.254) 6(5.588,0.254)
拨动开关
  oval 2x3 hole 1.3x2: 1(0,0) 2(4.7,0) 3(9.4,0)

## Nets
As in the schematic, except:
3V3: C17.2 C18.1 C69.1 C94.2 LED2.2 LED3.2 LED4.2 P1.1 P1.2 P1.3 P1.4 P1.5 P1.6 P1.7 P1.8 Q1.2 U1.1 U4.2 U5.2 U8.2 U8.4 U11.2 U17.19 U17.20 U18.8 U19.4 U20.4 U25.1 U26.1
GND: C10.1 C17.1 C18.2 C19.1 C20.2 C22.2 C68.2 C69.2 C93.1 C94.1 CN5.1 CN6.1 D1.2 P2.1 P2.2 P2.3 P2.4 P2.5 P2.6 P2.7 P2.8 R5.1 R6.2 R7.2 R8.2 R9.1 U1.2 U4.1 U4.3 U5.1 U6.6 U6.9 U8.1 U9.1 U11.1 U17.3 U17.4 U17.9 U17.10 U17.18 U18.7 U19.1 U20.1 U21.3 U22.3 U23.5 U24.5 U25.2 U26.4 U29.5 U30.5 U31.1 U31.2
DIR1: U4.22 U31.5
DIR2: U4.13 U31.6
EN1: U1.27 U31.7
EN2: U4.27 U31.8
OLED_SCL: U4.4 U5.3
OLED_SDA: U4.8 U5.4
PB7: U1.20 U31.4
PB17: U4.28 U31.3

Pads without a net: SCROW3 1; SCROW4 1; SCROW5 1; SW2 3 4 5; SW11 1 4 5; U6 2 3 5; U12 3; U18 2 3 4; U31 9 10

## Via types
v1: diameter 0.61, hole 0.305, Top Layer to Bottom Layer, 61 vias

## Routing (per net, layer and track width the routed paths; a pad name or vN(x,y) marks a point on that pad's centre or on a via; arc(x,y) is an arc through that point)
3V3: length 325.9
  Top Layer w0.254: U17.19 27.36,21.51 27.51,21.36 27.51,21 27.36,20.86 U17.20
  Top Layer w0.381: 23.28,21.5 23.23,21.45 ; 23.26,24.52 23.27,24.53
  Top Layer w0.508: U17.19 23.29,21.51
  Top Layer w0.762: v1(71.96,24.16) 73.53,24.16 74.75,22.94 P1.2 ; Q1.2 42.35,86.67 44.6,88.93 v1(44.6,91.57) ; LED2.2 66.75,3.94 67.31,3.38 78,3.38 78.89,4.27 78.89,9.83 79.76,10.69 87.25,10.69 88.39,11.84 88.39,19.81 87.81,20.4 P1.7 ; 70.59,75.18 70.59,86.21 U26.1 70.56,91.06 69.37,92.25 U11.2 69.37,96.32 68.81,96.88 52.58,96.88 51.82,96.11 ; C94.2 v1(47.31,40.7) 29.25,40.7 28.3,41.66 28.3,50.06 28.37,50.14 28.37,51.56 27.86,52.07 20.98,52.07 20.17,51.26 20.17,26.26 21.65,24.78 C18.1 ; C17.2 23.26,24.52 ; 51.82,96.11 51.05,96.88 24.46,96.88 23.8,96.22 U1.1 19.84,94.16 17.89,92.21 LED3.2 15.49,92.27 12.19,92.27 ; 51.82,96.11 U4.2 ; 70.54,75.18 70.56,75.16 ; U18.8 64.77,51.61 65.02,51.87 69.6,51.87 70.69,52.96 U20.4 70.69,67.54 U19.4 70.66,75.06
  Bottom Layer w0.762: v1(44.58,96.85) 44.6,96.83 v1(44.6,91.57) ; v1(71.96,24.16) 47.96,24.16 47.31,24.81 v1(47.31,40.7) 47.31,43.34 48.41,44.45 64.03,44.45 64.77,45.19 U18.8
+5V: length 221.3
  Top Layer w0.762: 60.42,12.73 60.43,12.74 v1(60.43,12.75) ; 60.42,12.73 C22.1 ; 60.42,12.73 60.42,8.67 61.04,8.05 LED1.2 ; 82.27,81.56 82.27,89.18 82.73,89.64 86.87,89.64 87.88,88.62 87.88,47.14 87.33,46.59 U29.2 84.09,46.59 83.36,47.32 U23.2 80.49,47.32 79.88,46.71 79.88,43.74 79.28,43.14 78.94,43.14 ; 78.94,43.14 C68.1 ; 78.94,43.14 79.91,42.17 79.91,30.68 P3.4 ; U24.2 8.84,47.68 6.93,47.68 6.05,46.79 U30.2 1.78,46.79 1.3,46.3 1.3,32.87 2.21,31.95 16.71,31.95 17.68,30.99 17.68,14.38 19.33,12.73 v1(35.74,12.73) ; U7.1 68.9,28.59 69.52,29.21 78.44,29.21 P3.2
  Bottom Layer w0.762: v1(35.74,12.73) 60.4,12.73 v1(60.43,12.75)
+12V: length 31.3
  Top Layer w1.016: SW2.2 26.57,6.07 ; 26.57,6.07 26.57,6.3 27.38,7.11 38.63,7.11 39.6,6.15 39.6,4.57 ; 26.57,6.07 25.55,7.09 18.19,7.09 17.32,6.22 SW11.3
GND: length 28.1
  Top Layer w0.254: U17.18 27.21,22.16 v1(27.41,22.35)
  Top Layer w0.381: U17.4 32.15,20.21 31.95,20.02 v1(31.95,17.27) ; v1(35.28,26.54) 35.28,24.39 35,24.11 U17.10
  Top Layer w0.508: v1(21.87,20.09) 21.87,21.52 C17.1
  Bottom Layer w0.381: v1(27.41,22.35) 32.84,22.35 35.28,24.79 v1(35.28,26.54) ; v1(17.09,78.74) v1(17.09,82.78)
  Bottom Layer w0.762: U4.1 U4.3
  vias: v1(13.8,78.74) v1(13.8,77.52) v1(13.8,76.3) v1(13.8,75.08) v1(14.92,78.74) v1(14.92,77.52) v1(14.92,76.3) v1(14.92,75.08) v1(15.98,78.74) v1(15.98,77.52) v1(15.98,76.3) v1(15.98,75.08) v1(17.09,77.52) v1(17.09,76.3) v1(17.09,75.08)
AIN1: length 65.5
  Top Layer w0.254: U17.21 23.87,20.21 v1(23.85,20.19)
  Bottom Layer w0.254: U4.30 50.55,57.33 37.36,57.33 36.86,56.82 36.86,24.44 32.61,20.19 v1(23.85,20.19)
AIN2: length 60.1
  Top Layer w0.254: v1(24.46,19.53) 24.49,19.56 U17.22
  Bottom Layer w0.254: U4.31 38.46,56.06 37.46,55.07 37.46,24.03 32.97,19.53 v1(24.46,19.53)
AO1: length 81.8
  Top Layer w0.254: U29.1 84.25,48.59 82.98,49.86 U23.1 ; v1(36.3,21.82) 36.3,19.24 35.97,18.91 U17.2
  Bottom Layer w0.254: v1(36.3,21.82) 37.29,22.81 72.36,22.81 73.74,24.18 73.74,48.87 74.73,49.86 U23.1
AO2: length 69.5
  Top Layer w0.254: U17.6 32.79,21.51 32.69,21.41 32.69,20.98 32.82,20.85 33.58,20.85 U17.5 ; U23.6 83.21,37.16 84.64,38.59 U29.6 ; 34.22,20.88 v1(35.56,20.88)
  Bottom Layer w0.254: v1(35.56,20.88) 72.89,20.88 74.73,22.71 74.73,36.27 75.62,37.16 U23.6
BIN1: length 64.6
  Top Layer w0.254: v1(25.15,22.8) 25.7,22.8 25.71,22.81 U17.17
  Bottom Layer w0.254: U1.13 21.16,78.92 20.45,78.21 20.45,23.62 21.03,23.04 24.91,23.04 v1(25.15,22.8)
BIN2: length 73
  Top Layer w0.254: v1(24.28,22.29) 24.28,23.09 24.65,23.46 U17.16
  Bottom Layer w0.254: v1(24.28,22.29) 20.13,22.29 19.63,22.78 19.63,83.36 20.27,84 U1.9
BO1: length 65.8
  Top Layer w0.254: U30.1 8.59,48.79 8.86,49.07 U24.1 ; v1(29.39,20.98) 29.41,21.01 29.41,25.1 29.73,25.41 U17.12 34.56,25.41 34.7,25.27 34.7,24.89 34.56,24.76 U17.11
  Bottom Layer w0.254: U24.1 9.92,50.19 9.94,50.22 11.86,50.22 12.52,49.56 12.52,22.05 13.59,20.98 v1(29.39,20.98)
BO2: length 52.2
  Top Layer w0.254: v1(30.99,18.8) 30.99,22.17 31.62,22.81 U17.8 ; U24.6 7.49,37.49 6.19,38.79 U30.6
  Bottom Layer w0.254: v1(30.99,18.8) 9.58,18.8 8.53,19.84 8.53,37.16 U24.6
BUZZER: length 43.8
  Top Layer w0.254: R10.2 40.44,54.03 39.9,53.49 31.06,53.49 29.79,54.76 29.79,63.17 29.29,63.68 U1.26
CCD_AO: length 33.6
  Top Layer w0.254: U4.11 47.32,81.46 46.96,81.81 46.96,89.69 47.7,90.42 65.84,90.42 66.83,91.42 U11.3
CCD_CLK: length 54
  Top Layer w0.254: v1(30.05,85.6) 31.27,85.6 32.16,86.49 32.16,91.92 32.97,92.74 63.93,92.74 64.29,93.09 U11.4
  Bottom Layer w0.254: U1.16 29.39,76.38 30.05,77.04 v1(30.05,85.6)
CCD_SI: length 36.7
  Top Layer w0.254: v1(61.04,88.57) 61.04,67.31 59.94,66.22 U4.24
  Bottom Layer w0.254: U11.5 61.75,90.22 61.04,89.51 v1(61.04,88.57)
DIR1: length 76.6
  Top Layer w0.254: U31.5 78.56,63.32 77.67,62.43 77.67,47.09 76.91,46.33 v1(61.04,46.33)
  Bottom Layer w0.254: U4.22 51.43,68.76 50.17,70.03 48.34,70.03 47.62,69.32 47.62,65.63 48.31,64.95 59.7,64.95 61.04,63.61 v1(61.04,46.33)
DIR2: length 65.1
  Bottom Layer w0.254: U31.6 85.21,63.32 86.13,64.24 86.13,84.33 85.37,85.09 60.35,85.09 59.59,84.33 59.59,80.8 59.11,80.31 49.5,80.31 49.28,80.09 U4.13
ECHO: length 82
  Bottom Layer w0.254: U21.1 84.86,88.06 84.43,88.49 80.44,88.49 80.16,88.77 80.16,96.95 79.15,97.97 30.05,97.97 29.03,96.95 29.03,84.35 28.68,84 U1.10
EN1: length 74.3
  Top Layer w0.254: v1(69.21,52.81) 30.48,52.81 29.16,54.13 29.16,62.05 28.83,62.38 24,62.38 23.8,62.18 U1.27
  Bottom Layer w0.254: v1(69.21,52.81) 78.28,52.81 79.65,54.18 79.65,60.38 80.05,60.78 U31.7
EN2: length 52.3
  Top Layer w0.254: U4.27 47.73,61.14 47.42,60.83 47.42,55.32 48.67,54.08 v1(67.82,54.08)
  Bottom Layer w0.254: U31.8 83.97,61.7 83.59,62.08 79.43,62.08 78.61,61.27 78.61,55.58 77.11,54.08 v1(67.82,54.08)
KEY1: length 21.5
  Top Layer w0.254: U1.8 25.12,85.32 19.94,85.32 19.38,84.76 19.38,80.75 18.49,79.86 SW6.1
KEY2: length 35.5
  Top Layer w0.254: SW8.1 8.52,72 7.98,72.54 7.98,80.67 8.48,81.18 17.2,81.18 18.52,82.5 18.52,90.73 19.41,91.62 U1.3
KEY3: length 55
  Top Layer w0.254: v1(35.2,68.68) 35.2,69.42 34.47,70.16 22.76,70.16 21.74,69.14 10.41,69.14 9.92,68.64 SW9.1
  Bottom Layer w0.254: v1(35.2,68.68) 35.2,59.89 36.7,58.39 49.07,58.39 U4.29
KEY4: length 72.7
  Top Layer w0.254: v1(31.8,67.49) 16.46,67.49 15.7,66.73 15.7,56.79 15.19,56.29 SW10.1
  Bottom Layer w0.254: v1(31.8,67.49) 31.8,86.23 33.43,87.86 51.36,87.86 51.82,88.32 U4.6
L_ENCA: length 34
  Top Layer w0.254: U1.30 25.07,57.33 17.6,57.33 16.71,56.44 16.71,45.95 15.88,45.11 U24.3 8.55,44.79 U30.3
L_ENCB: length 31.8
  Top Layer w0.254: U1.31 23.65,55.91 19,55.91 18.21,55.12 18.21,44.02 16.76,42.57 U24.4 8.64,42.79 U30.4
LED3: length 71.6
  Top Layer w0.254: R11.2 15.52,83.19 14.22,81.89 7.62,81.89 7.09,81.36 7.09,71.65 7.85,70.89 20.62,70.89 21.13,71.4 21.13,77.19 21.62,77.67 34.24,77.67 34.8,77.11 v1(34.8,76.33)
  Bottom Layer w0.254: U4.15 34.85,76.38 v1(34.8,76.33)
LED4: length 74.4
  Top Layer w0.254: v1(35.66,77.57) 35.66,75.82 35.03,75.18 22.43,75.18 22.02,74.78 22.02,70.71 21.31,70 6.83,70 5.87,70.97 5.87,82.32 6.48,82.93 11.05,82.93 12.14,84.02 R12.2
  Bottom Layer w0.254: U4.14 51.82,78.03 51.41,77.62 35.71,77.62 v1(35.66,77.57)
MPU_IN: length 34.7
  Top Layer w0.254: v1(44.78,53.54) 44.78,74.6 45.29,75.11 51.51,75.11 51.82,75.41 U4.16
  Bottom Layer w0.254: v1(44.78,53.54) 44.78,50.62 45.08,50.32 U18.1
MPU_SCL: length 67.9
  Top Layer w0.254: v1(39.6,54.86) 37.67,54.86 37.31,55.22 37.31,81.36 35.81,82.86 24.13,82.86 23.8,82.53 U1.11
  Bottom Layer w0.254: U18.6 59.69,53.82 58.65,54.86 v1(39.6,54.86)
MPU_SDA: length 60.4
  Top Layer w0.254: v1(38.28,54.2) 37.01,54.2 36.75,54.46 36.75,79.73 35.03,81.46 U1.12
  Bottom Layer w0.254: v1(38.28,54.2) 56.52,54.2 57.15,53.57 U18.5
OLED_SCL: length 61
  Bottom Layer w0.254: 30.91,50.14 30.91,89.31 32.13,90.53 50.72,90.53 U4.4
OLED_SDA: length 55.4
  Bottom Layer w0.254: U4.8 51.82,86.26 50.9,85.34 33.7,85.34 32.43,84.08 32.43,50.39 32.69,50.14 33.45,50.14
PA0: length 101.9
  Top Layer w0.254: v1(20.22,21.64) 20.22,19.3 20.62,18.9 25.54,18.9 25.55,18.91 U17.23
  Bottom Layer w0.254: v1(20.22,21.64) 33.12,21.64 35.86,24.38 35.86,57.66 34.06,59.46 34.06,81.08 35.56,82.58 50.39,82.58 U4.10
PA1: length 85.5
  Top Layer w0.254: U17.15 25.05,24.11 v1(25.04,24.1)
  Bottom Layer w0.254: U4.9 35.33,84 33.4,82.07 33.4,58.88 34.56,57.72 34.56,25.03 33.63,24.1 v1(25.04,24.1)
PA6: length 61.4
  Top Layer w0.254: U1.7 23.8,87.63 24.08,87.91 30.94,87.91 31.42,88.39 31.42,92.38 32.72,93.68 v1(47.42,93.68)
  Bottom Layer w0.254: v1(47.42,93.68) 47.42,95.56 47.83,95.96 67.18,95.96 68,95.15 68,86.26 U26.2
PA10: length 47.2
  Top Layer w0.254: v1(34.77,72.52) 34.65,72.52 34.59,72.47 24.23,72.47 23.8,72.9 U1.17
  Bottom Layer w0.254: v1(34.77,72.52) 34.8,72.54 50.32,72.54 50.57,72.29 50.57,70.48 51.03,70.03 65.05,70.03 65.58,69.49 U19.2
PA11: length 49.5
  Top Layer w0.254: v1(35.05,73.84) U1.18
  Bottom Layer w0.254: 68.12,67.56 68.12,71.75 67.23,72.64 51,72.64 50.65,73 50.65,74.88 50.39,75.13 35.43,75.13 35.05,74.75 v1(35.05,73.84)
PA21: length 46.8
  Top Layer w0.254: U4.25 47.14,63.68 46.79,63.32 46.79,54.84 48.26,53.37 68.68,53.37 69.32,54 69.32,60.91 68.83,61.39 65.94,61.39 65.61,61.06 U20.2
PA23: length 45.3
  Bottom Layer w0.254: U22.1 84.84,81.58 84.84,83.9 84.28,84.45 61.11,84.45 60.43,83.77 60.43,74.78 59.49,73.84 U4.18
PB7: length 98
  Top Layer w0.254: U31.4 82.76,64.64 77.6,64.64 76.99,64.03 76.99,48.01 76.15,47.17 v1(30.4,47.17)
  Bottom Layer w0.254: U1.20 26.37,71.27 28.88,71.27 29.57,70.59 29.57,48.01 v1(30.4,47.17)
PB15: length 88.4
  Top Layer w0.254: v1(62.71,52.17) 29.87,52.17 28.37,53.67 28.37,60.88 28.12,61.14 U1.28
  Bottom Layer w0.254: v1(62.71,52.17) 62.71,57.2 63.35,57.84 73.05,57.84 74.45,59.23 74.45,72.47 73.64,73.28 63.8,73.28 62.97,74.12 62.97,75.18
PB16: length 91.8
  Top Layer w0.254: U1.29 23.8,59.59 24.05,59.84 27.43,59.84 27.69,59.59 27.69,53.42 29.64,51.46 v1(63.6,51.46)
  Bottom Layer w0.254: v1(63.6,51.46) 63.6,56.64 64.08,57.12 74.07,57.12 75.56,58.62 75.56,73.05 74.6,74.02 65.79,74.02 65.51,74.3 U25.3
PB17: length 48
  Top Layer w0.254: U4.28 50.72,61.14 50.55,60.96 50.55,55.37 51.11,54.81 v1(68.48,54.81)
  Bottom Layer w0.254: U31.3 78.48,65.86 77.65,65.02 77.65,55.88 76.58,54.81 v1(68.48,54.81)
PB22: length 77.7
  Top Layer w0.254: U23.3 83.77,44.78 84.07,44.48 85.99,44.48 U29.3 ; v1(72.44,64.59) 75.23,64.59 75.49,64.85 75.49,69.37 76.33,70.21 v1(87.02,70.21)
  Bottom Layer w0.254: U4.21 49.28,67.74 49.53,67.49 59.21,67.49 62.1,64.59 v1(72.44,64.59) ; U29.3 87.42,44.59 87.99,45.16 87.99,69.93 87.71,70.21 v1(87.02,70.21)
PB23: length 82.9
  Top Layer w0.254: v1(73.66,65.99) 73.66,70.99 74.57,71.91 v1(86.92,71.91) ; U29.4 86.06,42.55 84.18,42.55 83.87,42.24 U23.4
  Bottom Layer w0.254: U4.20 65.76,71.3 66.8,70.26 66.8,66.29 67.1,65.99 v1(73.66,65.99) ; U29.4 88.23,42.59 88.9,43.26 88.9,71.15 88.16,71.88 86.94,71.88 v1(86.92,71.91)
TB_VM: length 73.2
  Top Layer w0.254: U17.13 25.56,25.41 25.45,25.3 25.45,24.84 25.53,24.76 U17.14
  Top Layer w0.381: U17.14 27.97,24.76 28.14,24.59 28.14,18.75 27.66,18.26 U17.24
  Top Layer w0.508: C20.1 28.55,27 28.55,26.99 28.55,26.11 27.85,25.41 U17.13
  Top Layer w0.762: C20.1 28.55,31.79 C19.2 28.58,33.2 29.16,33.78 36.78,33.78 37.51,33.05 37.51,16.33 36.75,15.57 v1(24.57,15.57)
  Bottom Layer w0.762: SW2.1 v1(24.57,15.57)
$1N1731: length 7.1
  Top Layer w0.762: R6.1 74.27,5.38 74.26,5.38 LED2.1
$1N1733: length 7.1
  Top Layer w0.762: LED1.1 74.26,8.06 74.27,8.05 R7.1
$1N2587: length 32.1
  Top Layer w0.254: SW10.2 2.02,57.04 2.01,57.05 2.01,84.12 2.41,84.53 R8.1
$1N2737: length 2.8
  Top Layer w0.254: LED3.1 15.57,90.49 15.57,87.7
$1N2739: length 2.9
  Top Layer w0.254: R12.1 12.14,90.51 12.19,90.56
$1N3007: length 8
  Top Layer w0.254: U28.1 41.39,88.03 41.4,88.02 Q1.3
$1N3009: length 2.8
  Top Layer w0.254: 40.39,75.89 40.45,75.95 Q1.1
$1N3011: length 17.4
  Top Layer w0.254: R9.2 38.3,88.57 37.69,89.18 U28.2
$1N21326: length 29
  Top Layer w1.016: CN6.2 5.92,15.15 CN5.2 14.5,15.09 15.32,14.28 SW11.2

## Copper pours and planes (outline as drawn; the poured copper is in the pictures)
3V3 on Top Layer: 48.76,42.8 63.35,42.8 63.35,38.71 48.76,38.71
3V3 on Top Layer: 75.69,24.69 88.77,24.69 88.77,18.49 75.69,18.49
3V3 on Top Layer: 25.55,21.77 27.66,21.77 27.66,20.6 25.55,20.6
+5V on Top Layer: 75.59,31.6 88.82,31.6 88.82,25.02 75.59,25.02
+5V on Top Layer: 58.12,34.21 70.76,34.21 70.76,16.69 58.12,16.69
+5V on Top Layer: 60.27,43.94 69.83,43.94 69.83,42.37 60.27,42.37
+12V on Top Layer: 46.86,28.5 51.94,28.5 51.94,27.43 46.86,27.43
+12V on Top Layer: 38.43,28.55 47.95,28.55 47.95,2.59 38.43,2.59
GND on Top Layer: 52.25,34.29 55.3,34.29 55.3,22.25 52.25,22.25
GND on Top Layer: 46.87,29.87 52.76,29.87 52.76,28.73 46.87,28.73
GND on Top Layer: 32.75,20.42 34.86,20.42 34.86,19.33 32.75,19.33
GND on Top Layer: 32.75,24.41 34.86,24.41 34.86,23.24 32.75,23.24
GND on Top Layer: 48.64,42.09 69.77,42.09 69.77,36.58 48.64,36.58
GND on Top Layer: 92.05,32.06 74.88,32.06 74.88,18.03 92.13,18.03 92.13,-2.31 -5.77,-2.31 -5.77,102.87 92.91,102.87 92.94,102.84 92.94,32.94
VCC on Top Layer: 42.16,8.46 55.27,8.46 55.27,0.97 42.16,0.97
AO1 on Top Layer: 32.75,19.11 34.86,19.11 34.86,18.02 32.75,18.02
AO2 on Top Layer: 32.75,21.74 34.86,21.74 34.86,20.57 32.75,20.57
BO1 on Top Layer: 32.75,25.76 34.86,25.76 34.86,24.59 32.75,24.59
BO2 on Top Layer: 32.75,23.09 34.86,23.09 34.86,21.92 32.75,21.92
TB_VM on Top Layer: 25.21,25.62 27.32,25.62 27.32,24.52 25.21,24.52
$1N2121 on Top Layer: 55.45,27.23 60.33,27.23 60.33,26.06 55.45,26.06
$1N2122 on Top Layer: 58.5,27.28 64.33,27.28 64.33,22.94 58.5,22.94
$1N2122 on Top Layer: 48.13,27.1 60.65,27.1 60.65,19.69 48.13,19.69
$1N2124 on Top Layer: 54.99,34.21 59.11,34.21 59.11,29.79 54.99,29.79

Small or netless copper shapes (teardrops, artwork), in the pictures only: 183 on Top Layer, 84 on Bottom Layer

## Text on the board
Top Silkscreen Layer: SDA | SCL | GND | VCC | ON | 3V3 | 5V | MOTOR_A | KEY1 | KEY2 | KEY3 | KEY4 | LED | OLED | TB6612 | MPU6050 | UART | US | POWER_LED | DCDC | LDO | MOTOR_B | MOTOR | CCD | Servo | 12V | + | DIR1 | DIR2 | PB14 | PB16 | PA10 | PB10 | PA13 | PB12 | PA4 | PB4 | PA6 | PB6 | PA8 | PB8 | PA2 | PB2 | PB1 | PA26 | PB26 | PB17 | PA17 | PA30 | PA28 | PA25 | PA15 | PA23 | PB23 | PA22 | PB19 | PA31 | PB21 | PA0 | G | A21 | 3V | A10 | A11 | A6 | ST1 | EN1 | ST2 | EN2 | B15 | B16
